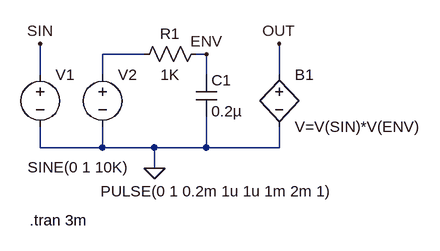
[diagram p0: schematic Fig_2-61_BV_Test.asc]
Fig_2-61_BV_Test.asc, the LTspice schematic file:
Version 4
SHEET 1 880 680
WIRE 192 96 128 96
WIRE 288 96 272 96
WIRE 32 128 32 80
WIRE 128 128 128 96
WIRE 288 128 288 96
WIRE 400 128 400 80
WIRE 32 240 32 208
WIRE 128 240 128 208
WIRE 128 240 32 240
WIRE 208 240 128 240
WIRE 288 240 288 192
WIRE 288 240 208 240
WIRE 400 240 400 208
WIRE 400 240 288 240
WIRE 208 272 208 240
FLAG 208 272 0
FLAG 32 80 SIN
FLAG 288 96 ENV
FLAG 400 80 OUT
SYMBOL voltage 32 112 R0
WINDOW 3 -19 158 Left 2
WINDOW 123 0 0 Left 2
WINDOW 39 0 0 Left 2
SYMATTR Value SINE(0 1 10K)
SYMATTR InstName V1
SYMBOL voltage 128 112 R0
WINDOW 3 -3 195 Left 2
WINDOW 123 0 0 Left 2
WINDOW 39 0 0 Left 2
SYMATTR Value PULSE(0 1 0.2m 1u 1u 1m 2m 1)
SYMATTR InstName V2
SYMBOL bv 400 112 R0
SYMATTR InstName B1
SYMATTR Value V=V(SIN)*V(ENV)
SYMBOL res 176 112 R270
WINDOW 0 32 56 VTop 2
WINDOW 3 0 56 VBottom 2
SYMATTR InstName R1
SYMATTR Value 1K
SYMBOL cap 272 128 R0
SYMATTR InstName C1
SYMATTR Value 0.2µ
TEXT 16 352 Left 2 !.tran 3m

The netlist it stands for:
* Fig_2-61_BV_Test.asc
V1 SIN 0 SINE(0 1 10K)
V2 N001 0 PULSE(0 1 0.2m 1u 1u 1m 2m 1)
B1 OUT 0 V=V(SIN)*V(ENV)
R1 N001 ENV 1K
C1 ENV 0 0.2µ
.tran 3m
.backanno
.end